# Altium schematic sheet Cp.SchDoc
size A4
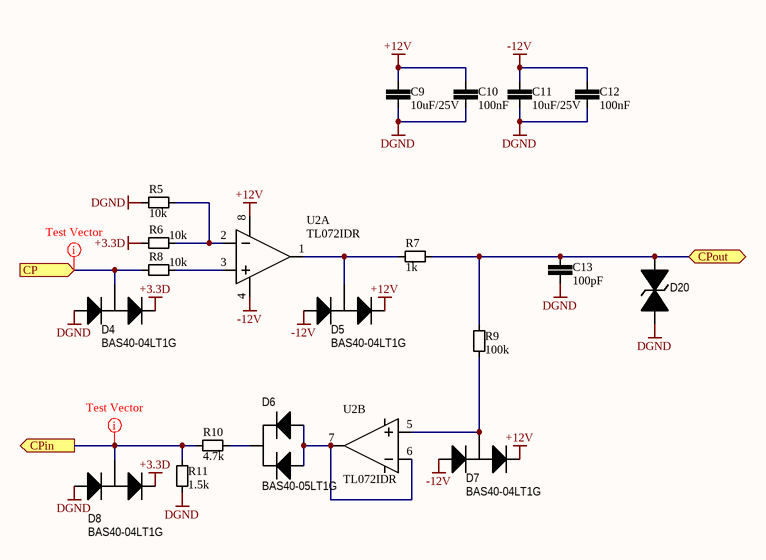
[diagram p0: Cp.SchDoc]

## Parts
C9  value 10uF/25V  [1206-C]  (hidden comment: Cap)
C10  value 100nF  [0603-C]  (hidden comment: Cap)
C11  value 10uF/25V  [1206-C]  (hidden comment: Cap)
C12  value 100nF  [0603-C]  (hidden comment: Cap)
C13  value 100pF  [0603-C]  (hidden comment: Cap)
D4  BAS40-04LT1G  [SOT-23_N]
D5  BAS40-04LT1G  [SOT-23_N]
D6  BAS40-05LT1G  [SOT-23_N]
D7  BAS40-04LT1G  [SOT-23_N]
D8  BAS40-04LT1G  [SOT-23_N]
D20  SMAJ12CA  [DO-214AC]  (value not drawn)
R5  value 10k  [0603-R]  (hidden comment: Res)
R6  value 10k  [0603-R]  (hidden comment: Res)
R7  value 1k  [0603-R]  (hidden comment: Res)
R8  value 10k  [0603-R]  (hidden comment: Res)
R9  value 100k  [0603-R]  (hidden comment: Res)
R10  value 4.7k  [0603-R]  (hidden comment: Res)
R11  value 1.5k  [0603-R]  (hidden comment: Res)
U2  TL072IDR  [SO-8_N]  (parts A,B of 2)

## Ports
CP (in), CPin (out), CPout (bidir)

## Nets
+3.3D: D4.2(K) D8.2(K) R6.1
+12V: C9.1 C10.1 D5.2(K) D7.2(K) U2.8
-12V: C11.1 C12.1 D5.1(A) D7.1(A) U2.4
DGND: C9.2 C10.2 C11.2 C12.2 C13.2 D4.1(A) D8.1(A) D20.1 R5.1 R11.1
CP: D4.3(C) R8.1 ; port CP
CPin: D8.3(C) R10.1 R11.2 ; port CPin
CPout: C13.1 D20.2 R7.2 R9.1 ; port CPout
NetD5_3: D5.3(C) R7.1 U2.1
NetD6_1: D6.1 D6.2 U2.6 U2.7
NetD6_3: D6.3 R10.2
NetD7_3: D7.3(C) R9.2 U2.5
NetR5_2: R5.2 R6.2 U2.2
NetR8_2: R8.2 U2.3

## Layout directives
Column: TestVectorIndex: CP, CPin

## Library data of the parts
C9 C11 = C21E010UK1E0: MLCC 10uF 10% 25V X7R 1206; TemperatureRange: -55°C to 150°C; VenderID: MLCC-1206-25V-106K-X7R; Published: 1-Jun-2017; Publisher: GreenBox; MountType: SMT; PackageReference: 1206; Manufacturer: *
C10 C12 = C21C100NK1H0: MLCC 100nF 10% 50V X7R 0603; TemperatureRange: -55°C to 150°C; VenderID: MLCC-0603-50V-104K-X7R; Published: 1-Jun-2017; Publisher: GreenBox; MountType: SMT; PackageReference: 0603; Manufacturer: *
C13 = C11C100PJ1H0: MLCC 100pF 5% 50V NPO 0603; TemperatureRange: -55°C to 150°C; VenderID: MLCC-0603-50V-101J-NPO; Published: 1-Jun-2017; Publisher: GreenBox; MountType: SMT; PackageReference: 0603; Manufacturer: *
D4 D5 D7 D8 = D742BAS4004O: Dual Series Schottky Barrier Diode BAS40-04LT1G Vrrm 40V If 0.12A Ir 1uA; Manufacturer: ON SEMICONDUCTOR; TemperatureRange: -55 to 150°C; MountType: SMT; PackageReference: SOT-23; Published: 1-Jun-2017; Publisher: GreenBox; VenderID: BAS40-04LT1G
D6 = D842BAS4005O: Dual Series Schottky Barrier Diode BAS40-05LT1G Vrrm 40V If 0.12A Ir 1uA; Manufacturer: ON SEMICONDUCTOR; TemperatureRange: -55 to 150°C; MountType: SMT; PackageReference: SOT-23; Published: 1-Jun-2017; Publisher: GreenBox; VenderID: BAS40-05LT1G
D20 = DT61SMAJ1220: TVS BIDIRECTIONAL SMAJ12CA Vbr 13.3V Vc/Ipp 19.9V/20.1A; TemperatureRange: -55 to 150°C; Manufacturer: *; MountType: SMT; PackageReference: DO-214AC; Published: 1-Jun-2017; Publisher: GreenBox; VenderID: SMAJ12CA
R5 R6 R8 = R11C010KFBF0: SMD Resistor 10k 1% 1/10W 0603 100PPM; TemperatureRange: -55°C to 150°C; VenderID: RES-0603-10k-1%; Published: 1-Jun-2017; Publisher: GreenBox; MountType: SMT; PackageReference: 0603; Manufacturer: *
R7 = R11C001KFBF0: SMD Resistor 1k 1% 1/10W 0603 100PPM; TemperatureRange: -55°C to 150°C; VenderID: RES-0603-1k-1%; Published: 1-Jun-2017; Publisher: GreenBox; MountType: SMT; PackageReference: 0603; Manufacturer: *
R9 = R11C100KFBF0: SMD Resistor 100k 1% 1/10W 0603 100PPM; TemperatureRange: -55°C to 150°C; VenderID: RES-0603-100k-1%; Published: 1-Jun-2017; Publisher: GreenBox; MountType: SMT; PackageReference: 0603; Manufacturer: *
R10 = R11C04K7FBF0: SMD Resistor 4.7k 1% 1/10W 0603 100PPM; TemperatureRange: -55°C to 150°C; VenderID: RES-0603-4k7-1%; Published: 1-Jun-2017; Publisher: GreenBox; MountType: SMT; PackageReference: 0603; Manufacturer: *
R11 = R11C01K5FBF0: SMD Resistor 1.5k 1% 1/10W 0603 100PPM; TemperatureRange: -55°C to 150°C; VenderID: RES-0603-1k5-1%; Published: 1-Jun-2017; Publisher: GreenBox; MountType: SMT; PackageReference: 0603; Manufacturer: *
U2 = UOS1TLC072IT: Dual Operational Amplifier TL072IDR Vcc ±18V Vio 3mV; Manufacturer: TEXAS INSTRUMENTS; TemperatureRange: -40°C to 85°C; Publisher: GreenBox; Published: 1-Jan-2016; PackageReference: SOIC(8); MountType: SMT; VenderID: TL072IDR; PackageDescription: 8-Pin Small Outline Integrated Circuit 1.27 mm Pitch